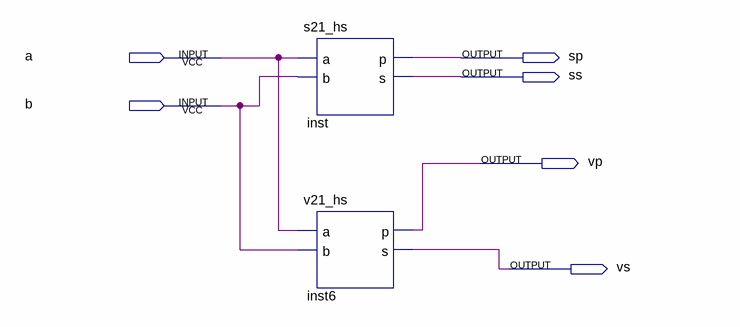
[diagram p0: schematic sheet]
// Quartus schematic sv21_hs.bdf as structural Verilog: 2 symbols, 6 pins
module sv21_hs (
  input  a,
  input  b,
  output sp,
  output ss,
  output vp,
  output vs
);

  s21_hs inst (.a(a), .b(b), .p(sp), .s(ss));
  v21_hs inst6 (.a(a), .b(b), .p(vp), .s(vs));
endmodule
